# Altium project Akhromsote.PrjPcb
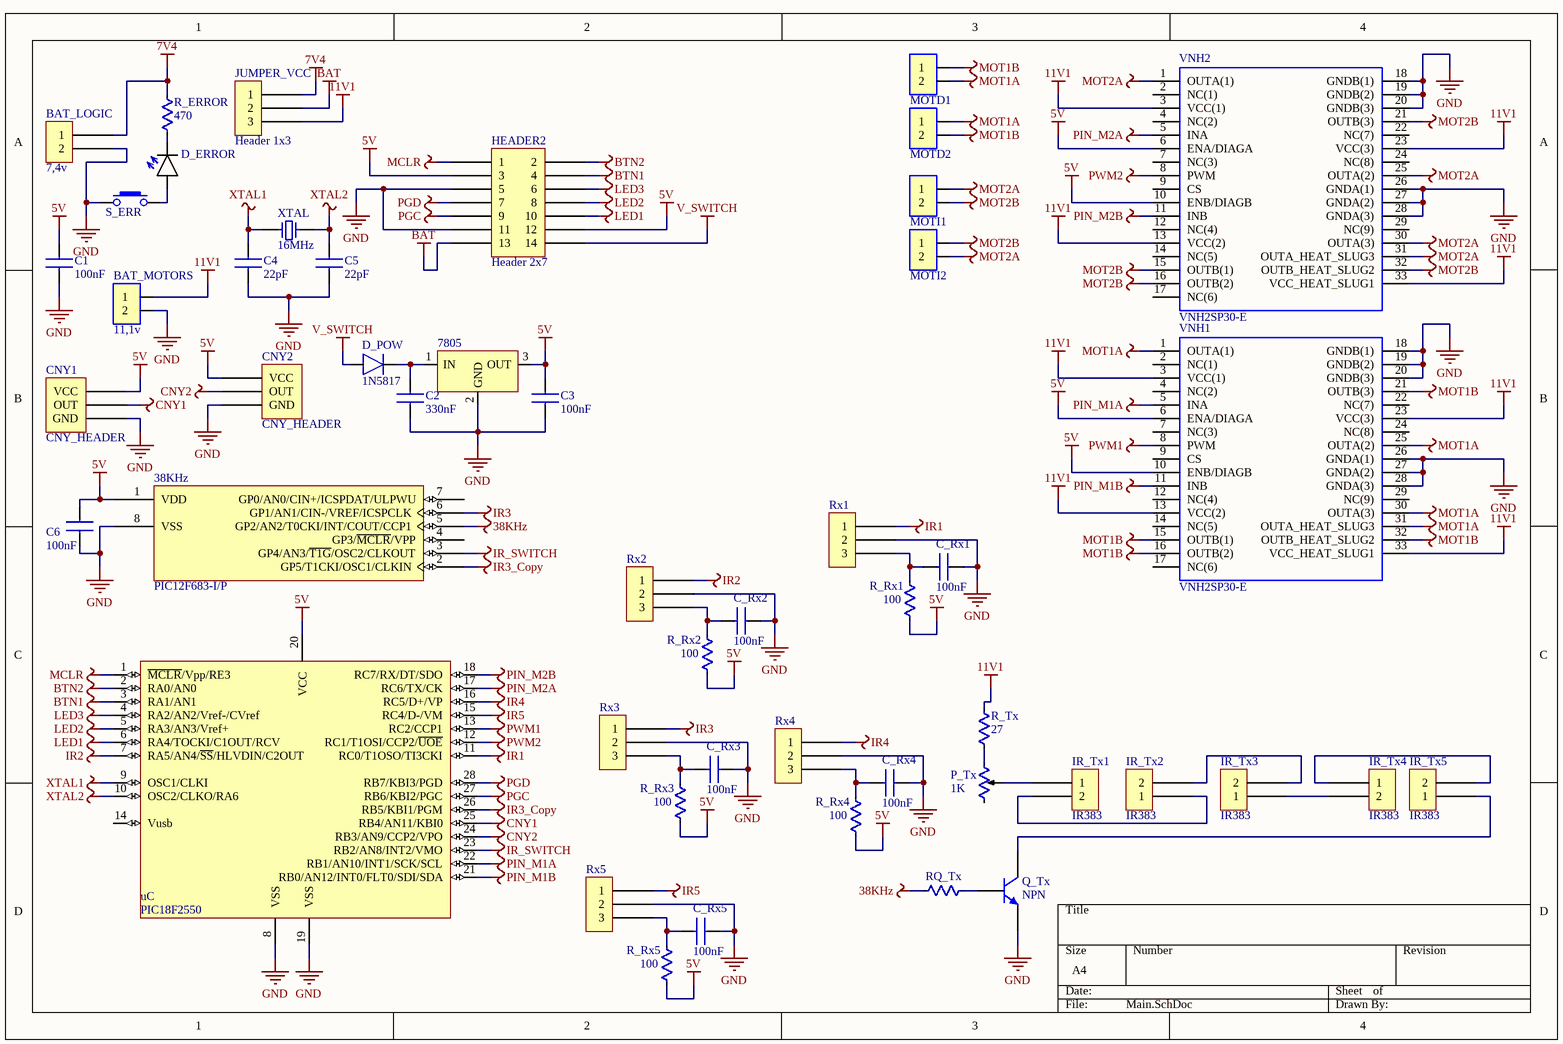
[diagram p0: Main.SchDoc]
3 sheets, 65 parts. Net scope: global (net labels, ports and power ports of the same name join across sheets).
Board files: Main.PcbDoc, UI.PcbDoc, IR.PcbDoc
Sheets:
  Main.SchDoc
  UI.SchDoc
  IR.SchDoc

## Sheet Main.SchDoc
size A4

### Parts
38KHz  PIC12F683-I/P  [PDIP300-P8]
7805  LM78XX  [TO-220-STRAIGHT]  (value not drawn)
BAT_LOGIC  7,4v  [HEADER 1x2]
BAT_MOTORS  11,1v  [BLOCK_TERMINAL-2]
C1  value 100nF  [CAP-CER]  (hidden comment: CAP-CER)
C2  value 330nF  [CAP-CER]  (hidden comment: CAP-CER)
C3  value 100nF  [CAP-CER]  (hidden comment: CAP-CER)
C4  value 22pF  [CAP-CER]  (hidden comment: CAP-CER)
C5  value 22pF  [CAP-CER]  (hidden comment: CAP-CER)
C6  value 100nF  [CAP-CER]  (hidden comment: CAP-CER)
C_Rx1  value 100nF  [CAP-CER]  (hidden comment: CAP-CER)
C_Rx2  value 100nF  [CAP-CER]  (hidden comment: CAP-CER)
C_Rx3  value 100nF  [CAP-CER]  (hidden comment: CAP-CER)
C_Rx4  value 100nF  [CAP-CER]  (hidden comment: CAP-CER)
C_Rx5  value 100nF  [CAP-CER]  (hidden comment: CAP-CER)
CNY1  CNY_HEADER  [CNY_HEADER]
CNY2  CNY_HEADER  [CNY_HEADER]
D_ERROR  LED  [LED-3MM-RED]  (value not drawn)
D_POW  NAME: 1N5817  [DO-41]  (hidden comment: DIODE)
HEADER2  Header 2x7  [HEADER 2x7]
IR_Tx1  IR383  [HEADER 1x2]
IR_Tx2  IR383  [HEADER 1x2]
IR_Tx3  IR383  [HEADER 1x2]
IR_Tx4  IR383  [HEADER 1x2]
IR_Tx5  IR383  [HEADER 1x2]
JUMPER_VCC  Header 1x3  [Header 1x3]
MOTD1  2-BLOCK_TERMINAL  [BLOCK_TERMINAL-2]  (value not drawn)
MOTD2  2-BLOCK_TERMINAL  [BLOCK_TERMINAL-2]  (value not drawn)
MOTI1  2-BLOCK_TERMINAL  [BLOCK_TERMINAL-2]  (value not drawn)
MOTI2  2-BLOCK_TERMINAL  [BLOCK_TERMINAL-2]  (value not drawn)
P_Tx  value 1K  [POT-10TURN]  (hidden comment: POT)
Q_Tx  NPN  [TO-92]
R_ERROR  value 470  [RES-Axial-400mil]  (hidden comment: RES)
R_Rx1  value 100  [RES-Axial-400mil]  (hidden comment: RES)
R_Rx2  value 100  [RES-Axial-400mil]  (hidden comment: RES)
R_Rx3  value 100  [RES-Axial-400mil]  (hidden comment: RES)
R_Rx4  value 100  [RES-Axial-400mil]  (hidden comment: RES)
R_Rx5  value 100  [RES-Axial-400mil]  (hidden comment: RES)
R_Tx  value 27  [RES-Axial-400mil]  (hidden comment: RES)
RQ_Tx  RES  [RES-Axial-400mil]  (value not drawn)
Rx1  Header 1x3  [Header 1x3]  (value not drawn)
Rx2  Header 1x3  [Header 1x3]  (value not drawn)
Rx3  Header 1x3  [Header 1x3]  (value not drawn)
Rx4  Header 1x3  [Header 1x3]  (value not drawn)
Rx5  Header 1x3  [Header 1x3]  (value not drawn)
S_ERR  BUTTON_SMALL_4PIN  [TACT_SWITCH-SMALL-4PIN]  (value not drawn)
uC  PIC18F2550  [DIP28]
VNH1  VNH2SP30-E  [MULTIPOWER-SO-30]
VNH2  VNH2SP30-E  [MULTIPOWER-SO-30]
XTAL  FREQUENCY: 16MHz  [HC-49/S]  (hidden comment: XTAL)

### Nets
5V: 38KHz.1(VDD) 7805.3(OUT) C1.2 C3.2 C6.2 CNY1.2(VCC) CNY2.2(VCC) HEADER2.3 HEADER2.12 R_Rx1.1 R_Rx2.1 R_Rx3.1 R_Rx4.1 R_Rx5.1 uC.20(VCC) VNH1.6(ENA/DIAGA) VNH1.10(ENB/DIAGB) VNH2.6(ENA/DIAGA) VNH2.10(ENB/DIAGB)
7V4: BAT_LOGIC.1 JUMPER_VCC.1 R_ERROR.2
11V1: BAT_MOTORS.1 JUMPER_VCC.3 R_Tx.2 VNH1.3(VCC(1)) VNH1.13(VCC(2)) VNH1.23(VCC(3)) VNH1.33(VCC_HEAT_SLUG1) VNH2.3(VCC(1)) VNH2.13(VCC(2)) VNH2.23(VCC(3)) VNH2.33(VCC_HEAT_SLUG1)
38KHz: 38KHz.5(GP2/AN2/T0CKI/INT/COUT/CCP1) RQ_Tx.1
BAT: HEADER2.13 JUMPER_VCC.2
BTN1: HEADER2.4 uC.3(RA1/AN1)
BTN2: HEADER2.2 uC.2(RA0/AN0)
CNY1: CNY1.3(OUT) uC.25(RB4/AN11/KBI0)
CNY2: CNY2.3(OUT) uC.24(RB3/AN9/CCP2/VPO)
GND: 38KHz.8(VSS) 7805.2(GND) BAT_LOGIC.2 BAT_MOTORS.2 C1.1 C2.1 C3.1 C4.1 C5.1 C6.1 C_Rx1.2 C_Rx2.2 C_Rx3.2 C_Rx4.2 C_Rx5.2 CNY1.1(GND) CNY2.1(GND) HEADER2.5 HEADER2.11 Q_Tx.E Rx1.2 Rx2.2 Rx3.2 Rx4.2 Rx5.2 S_ERR.1 uC.8(VSS) uC.19(VSS) VNH1.18(GNDB(1)) VNH1.19(GNDB(2)) VNH1.20(GNDB(3)) VNH1.26(GNDA(1)) VNH1.27(GNDA(2)) VNH1.28(GNDA(3)) VNH2.18(GNDB(1)) VNH2.19(GNDB(2)) VNH2.20(GNDB(3)) VNH2.26(GNDA(1)) VNH2.27(GNDA(2)) VNH2.28(GNDA(3))
IR1: Rx1.1 uC.11(RC0/T1OSO/TI3CKI)
IR2: Rx2.1 uC.7(RA5/AN4/~{SS}/HLVDIN/C2OUT)
IR3: 38KHz.6(GP1/AN1/CIN-/VREF/ICSPCLK) Rx3.1
IR3_Copy: 38KHz.2(GP5/T1CKI/OSC1/CLKIN) uC.26(RB5/KBI1/PGM)
IR4: Rx4.1 uC.16(RC5/D+/VP)
IR5: Rx5.1 uC.15(RC4/D-/VM)
IR_SWITCH: 38KHz.3(GP4/AN3/~{T1G}/OSC2/CLKOUT) uC.23(RB2/AN8/INT2/VMO)
LED1: HEADER2.10 uC.6(RA4/TOCKI/C1OUT/RCV)
LED2: HEADER2.8 uC.5(RA3/AN3/Vref+)
LED3: HEADER2.6 uC.4(RA2/AN2/Vref-/CVref)
MCLR: HEADER2.1 uC.1(~{MCLR}/Vpp/RE3)
MOT1A: MOTD1.2 MOTD2.1 VNH1.1(OUTA(1)) VNH1.25(OUTA(2)) VNH1.30(OUTA(3)) VNH1.31(OUTA_HEAT_SLUG3)
MOT1B: MOTD1.1 MOTD2.2 VNH1.15(OUTB(1)) VNH1.16(OUTB(2)) VNH1.21(OUTB(3)) VNH1.32(OUTB_HEAT_SLUG2)
MOT2A: MOTI1.1 MOTI2.2 VNH2.1(OUTA(1)) VNH2.25(OUTA(2)) VNH2.30(OUTA(3)) VNH2.31(OUTA_HEAT_SLUG3)
MOT2B: MOTI1.2 MOTI2.1 VNH2.15(OUTB(1)) VNH2.16(OUTB(2)) VNH2.21(OUTB(3)) VNH2.32(OUTB_HEAT_SLUG2)
PGC: HEADER2.9 uC.27(RB6/KBI2/PGC)
PGD: HEADER2.7 uC.28(RB7/KBI3/PGD)
PIN_M1A: uC.22(RB1/AN10/INT1/SCK/SCL) VNH1.5(INA)
PIN_M1B: uC.21(RB0/AN12/INT0/FLT0/SDI/SDA) VNH1.11(INB)
PIN_M2A: uC.17(RC6/TX/CK) VNH2.5(INA)
PIN_M2B: uC.18(RC7/RX/DT/SDO) VNH2.11(INB)
PWM1: uC.13(RC2/CCP1) VNH1.8(PWM)
PWM2: uC.12(RC1/T1OSI/CCP2/~{UOE}) VNH2.8(PWM)
V_SWITCH: D_POW.A HEADER2.14
XTAL1: C4.2 uC.9(OSC1/CLKI) XTAL.2
XTAL2: C5.2 uC.10(OSC2/CLKO/RA6) XTAL.1
Net7805_1: 7805.1(IN) C2.2 D_POW.K
NetC_Rx1_1: C_Rx1.1 R_Rx1.2 Rx1.3
NetC_Rx2_1: C_Rx2.1 R_Rx2.2 Rx2.3
NetC_Rx3_1: C_Rx3.1 R_Rx3.2 Rx3.3
NetC_Rx4_1: C_Rx4.1 R_Rx4.2 Rx4.3
NetC_Rx5_1: C_Rx5.1 R_Rx5.2 Rx5.3
NetD_ERROR_A: D_ERROR.A S_ERR.2
NetD_ERROR_K: D_ERROR.K R_ERROR.1
NetIR_Tx1_1: IR_Tx1.1 P_Tx.2
NetIR_Tx1_2: IR_Tx1.2 IR_Tx2.1
NetIR_Tx2_2: IR_Tx2.2 IR_Tx3.2
NetIR_Tx3_1: IR_Tx3.1 IR_Tx4.2
NetIR_Tx4_1: IR_Tx4.1 IR_Tx5.2
NetIR_Tx5_1: IR_Tx5.1 Q_Tx.C
NetP_Tx_1: P_Tx.1 R_Tx.1
NetQ_Tx_B: Q_Tx.B RQ_Tx.2

Not connected (* = marked no-connect by the designer): 38KHz 4(GP3/~{MCLR}/VPP) 7(GP0/AN0/CIN+/ICSPDAT/ULPWU); P_Tx 3; uC 14(Vusb); VNH1 2(NC(1)) 4(NC(2)) 7(NC(3)) 9(CS) 12(NC(4)) 14(NC(5)) 17(NC(6)) 22(NC(7)) 24(NC(8)) 29(NC(9)); VNH2 2(NC(1)) 4(NC(2)) 7(NC(3)) 9(CS) 12(NC(4)) 14(NC(5)) 17(NC(6)) 22(NC(7)) 24(NC(8)) 29(NC(9))

### Library data of the parts
38KHz = PIC12F683-I/P: Flash-Based 8-Bit CMOS Microcontroller with nanoWatt Technology, 2K (x14-Bit words) Program Memory, 384 Bytes Data Memory, 8-Pin PDIP, Industrial Temperature; Published: 29-Jan-2009; LatestRevisionDate: 02-Dec-2009; LatestRevisionNote: Updated to datasheet revision revD, Feb-2007.; DatasheetVersion: revD, Feb-2007; PackageVersion: revBB, Aug-2009; PackageReference: PDIP300-P8; Publisher: Altium Limited; PackageDescription: 8-Lead Plastic Dual In-Line (P) - 300 mil Body [PDIP]; Supplier 1: Digi-Key; Supplier Part Number 1: PIC12F683-I/P-ND; Supplier 2: Farnell; Supplier Part Number 2: 9759034; Supplier 3: Farnell; Supplier Part Number 3: 1523923; Code_JEDEC: MS-001; ComponentLink1Description: Datasheet; ComponentLink1URL: http://ww1.microchip.com/downloads/en/DeviceDoc/41211D_.pdf; ComponentLink2Description: Packaging Specification; ComponentLink2URL: http://www.microchip.com/stellent/groups/techpub_sg/documents/packagingspec/en012702.pdf; ComponentLink3Description: Microchip.com Home; ComponentLink3URL: http://www.microchip.com/
BAT_LOGIC IR_Tx1-IR_Tx5 = Header 1x2
BAT_MOTORS = 2-BLOCK_TERMINAL
VNH1 VNH2 = VNH2SP30-E: H-Bridge Motor Driver 30A MultiPowerSO30 STMicroelectronics VNH2SP30-E, Half Bridge Motor Driver, Automotive, 30-Pin SOIC; Supplier_Name: DigiKey; DigiKey Part Number: 497-4500-5-ND; Manufacturer_Name: STMicroelectronics; Manufacturer_Part_Number: VNH2SP30-E; Datasheet Link: http://www.st.com/content/ccc/resource/technical/document/datasheet/group2/66/b8/f5/2c/9a/66/41/c7/CD00043711/files/CD00043711.pdf/jcr:content/translations/en.CD00043711.pdf; 3D Package: *

## Sheet UI.SchDoc
size A4
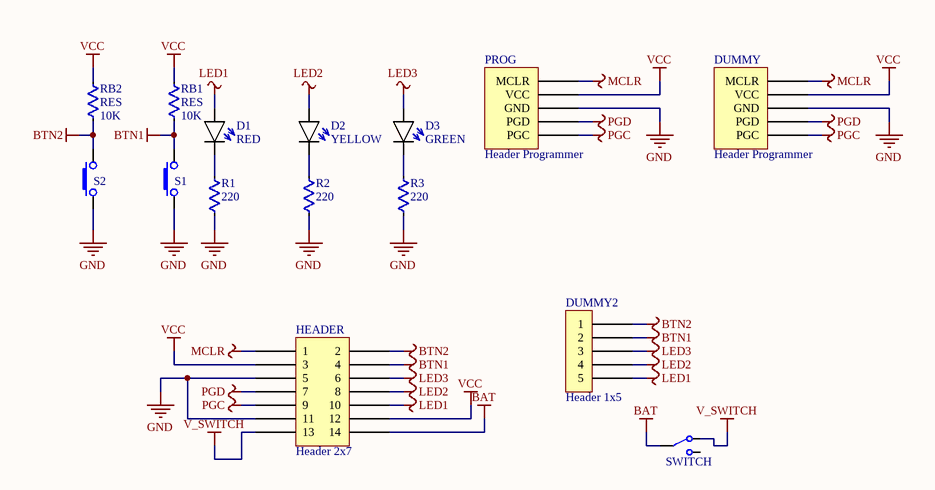
[diagram p1: UI.SchDoc]

### Parts
D1  COLOR: RED  [LED-3MM-RED]  (hidden comment: LED)
D2  COLOR: YELLOW  [LED-3MM-YELLOW]  (hidden comment: LED)
D3  COLOR: GREEN  [LED-3MM-GREEN]  (hidden comment: LED)
DUMMY  Header Programmer  [Header 1x5]
DUMMY2  Header 1x5  [Header 1x5]
HEADER  Header 2x7  [HEADER 2x7]
PROG  Header Programmer  [Header 1x5]
R1  value 220  [RES-Axial-400mil]  (hidden comment: RES)
R2  value 220  [RES-Axial-400mil]  (hidden comment: RES)
R3  value 220  [RES-Axial-400mil]  (hidden comment: RES)
RB1  RES  value 10K  [RES-Axial-400mil]
RB2  RES  value 10K  [RES-Axial-400mil]
S1  BUTTON_SMALL_4PIN  [TACT_SWITCH-SMALL-4PIN]  (value not drawn)
S2  BUTTON_SMALL_4PIN  [TACT_SWITCH-SMALL-4PIN]  (value not drawn)
SWITCH  SLIDE-SWITCH  [SWITCH]  (value not drawn)

### Nets
BAT: HEADER.14 SWITCH.2
BTN1: DUMMY2.2 HEADER.4 RB1.1 S1.2
BTN2: DUMMY2.1 HEADER.2 RB2.1 S2.2
GND: DUMMY.3(GND) HEADER.5 HEADER.11 PROG.3(GND) R1.1 R2.1 R3.1 S1.1 S2.1
LED1: D1.A DUMMY2.5 HEADER.10
LED2: D2.A DUMMY2.4 HEADER.8
LED3: D3.A DUMMY2.3 HEADER.6
MCLR: DUMMY.1(MCLR) HEADER.1 PROG.1(MCLR)
PGC: DUMMY.5(PGC) HEADER.9 PROG.5(PGC)
PGD: DUMMY.4(PGD) HEADER.7 PROG.4(PGD)
V_SWITCH: HEADER.13 SWITCH.1
VCC: DUMMY.2(VCC) HEADER.3 HEADER.12 PROG.2(VCC) RB1.2 RB2.2
NetD1_K: D1.K R1.2
NetD2_K: D2.K R2.2
NetD3_K: D3.K R3.2

Not connected (* = marked no-connect by the designer): SWITCH 3

## Sheet IR.SchDoc
size A4

## Nets that join several sheets
BAT: Main (HEADER2.13 JUMPER_VCC.2), UI (HEADER.14 SWITCH.2)
BTN1: Main (HEADER2.4 uC.3), UI (DUMMY2.2 HEADER.4 RB1.1 S1.2)
BTN2: Main (HEADER2.2 uC.2), UI (DUMMY2.1 HEADER.2 RB2.1 S2.2)
GND: Main (40 pins), UI (9 pins)
LED1: Main (HEADER2.10 uC.6), UI (D1.A DUMMY2.5 HEADER.10)
LED2: Main (HEADER2.8 uC.5), UI (D2.A DUMMY2.4 HEADER.8)
LED3: Main (HEADER2.6 uC.4), UI (D3.A DUMMY2.3 HEADER.6)
MCLR: Main (HEADER2.1 uC.1), UI (DUMMY.1 HEADER.1 PROG.1)
PGC: Main (HEADER2.9 uC.27), UI (DUMMY.5 HEADER.9 PROG.5)
PGD: Main (HEADER2.7 uC.28), UI (DUMMY.4 HEADER.7 PROG.4)
V_SWITCH: Main (D_POW.A HEADER2.14), UI (HEADER.13 SWITCH.1)